# Altium schematic sheet Input.SchDoc
size A4
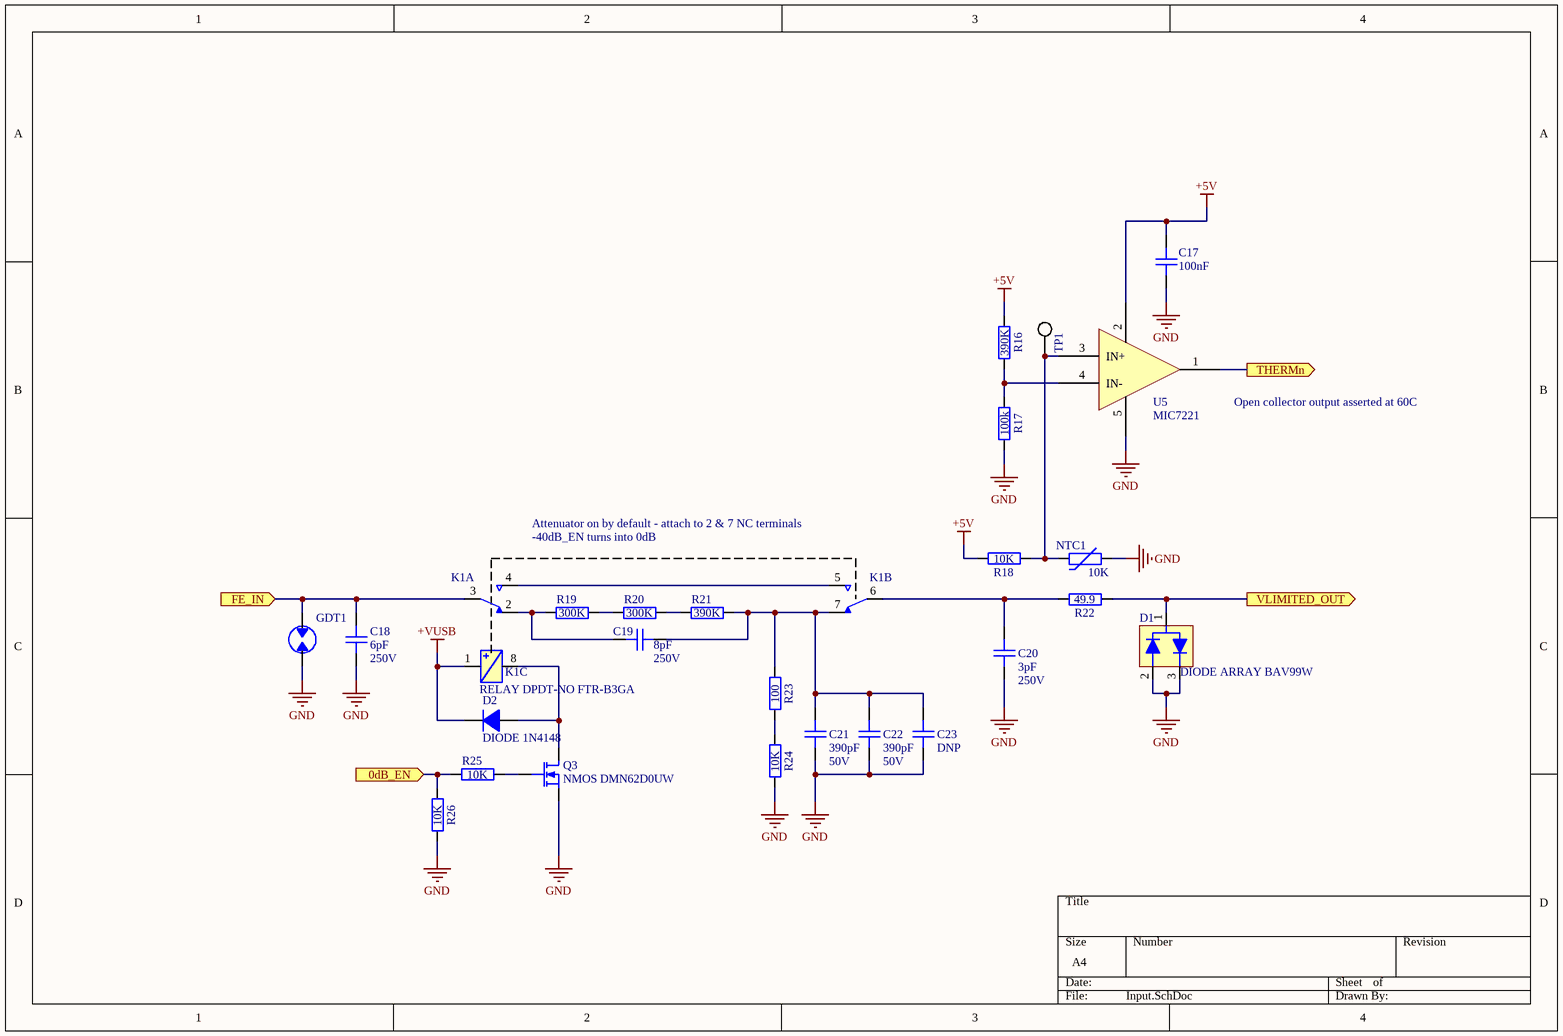
[diagram p0: Input.SchDoc]

## Parts
C17  value 100nF  [GEN_C_0402]  (hidden comment: CAP 100nF 16V X7R 0402)
C18  value 6pF  Voltage Rating: 250V  [GEN_C_0603]  (hidden comment: CAP 6pF 250V C0G 0603)
C19  value 8pF  Voltage Rating: 250V  [GEN_C_0603]  (hidden comment: CAP 8pF 250V C0G 0603)
C20  value 3pF  Voltage Rating: 250V  [GEN_C_0603]  (hidden comment: CAP 3pF 250V C0G 0603)
C21  value 390pF  Voltage Rating: 50V  [GEN_C_0402]  (hidden comment: CAP 390pF 50V C0G 0402)
C22  value 390pF  Voltage Rating: 50V  [GEN_C_0402]  (hidden comment: CAP 390pF 50V C0G 0402)
C23  value DNP  [GEN_C_0402]  (hidden comment: CAP DNP 0402)
D1  DIODE ARRAY BAV99W  [GEN_SOT_323]
D2  DIODE 1N4148  [GEN_SOD_323]
GDT1  GDT 90V  [BOU_2051]  (value not drawn)
K1  RELAY DPDT-NO FTR-B3GA  [FUJ_FTR-B3GA]  (value not drawn)  (parts A,B,C of 3)
NTC1  value 10K  [GEN_R_0402]  (hidden comment: NTC 10K 3900K 0402)
Q3  NMOS DMN62D0UW  [GEN_SOT_323]
R16  value 390K  [GEN_R_0402]  (hidden comment: RES 390K OHM 1% 1/10W 0402)
R17  value 100k  [GEN_R_0402]  (hidden comment: RES 100K OHM 1% 1/10W 0402)
R18  value 10K  [GEN_R_0402]  (hidden comment: RES 10K OHM 1% 1/10W 0402)
R19  value 300K  [GEN_R_0402]  (hidden comment: RES 300K OHM 1% 1/10W 0402)
R20  value 300K  [GEN_R_0402]  (hidden comment: RES 300K OHM 1% 1/10W 0402)
R21  value 390K  [GEN_R_0402]  (hidden comment: RES 390K OHM 1% 1/10W 0402)
R22  49.9  [GEN_R_0402]
R23  value 100  [GEN_R_0402]  (hidden comment: RES 100 OHM 1% 1/10W 0402)
R24  value 10K  [GEN_R_0402]  (hidden comment: RES 10K OHM 1% 1/10W 0402)
R25  value 10K  [GEN_R_0402]  (hidden comment: RES 10K OHM 1% 1/10W 0402)
R26  value 10K  [GEN_R_0402]  (hidden comment: RES 10K OHM 1% 1/10W 0402)
TP1  5019  [KEY_5019]  (value not drawn)
U5  MIC7221  [GEN_SOT23_5_950_2900X1600X1450]

## Ports
0dB_EN (in), FE_IN (in), THERMn (out), VLIMITED_OUT (out)

## Nets
+5V: C17.1 R16.1 R18.2 U5.2(V+)
+VUSB: D2.1(K) K1.1
GND: C17.2 C18.1 C20.2 C21.1 C22.1 C23.1 D1.2 D1.3 GDT1.2 NTC1.2 Q3.3(S) R17.2 R24.1 R26.1 U5.5(V-)
0dB_EN: R25.2 R26.2 ; port 0dB_EN
FE_IN: C18.2 GDT1.1 K1.3 ; port FE_IN
THERMn: U5.1(OUT) ; port THERMn
VLIMITED_OUT: D1.1 R22.2 ; port VLIMITED_OUT
NetC19_1: C19.1 C21.2 C22.2 C23.2 K1.7 R21.2 R23.2
NetC19_2: C19.2 K1.2 R19.1
NetC20_1: C20.1 K1.6 R22.1
NetD2_2: D2.2(A) K1.8 Q3.1(D)
NetK1_4: K1.4 K1.5
NetNTC1_1: NTC1.1 R18.1 TP1.1 U5.3(IN+)
NetQ3_2: Q3.2(G) R25.1
NetR16_2: R16.2 R17.1 U5.4(IN-)
NetR19_2: R19.2 R20.1
NetR20_2: R20.2 R21.1
NetR23_1: R23.1 R24.2

## Notes on the sheet
- Open collector output asserted at 60C
- Attenuator on by default - attach to 2 & 7 NC terminals
- -40dB_EN turns into 0dB

## Library data of the parts
D2 = DIODE 1N4148: Max Reverse Voltage: 75V; Max Current: 150mA; Supplier 1: Digi-Key; Supplier Part Number 1: 1N4148WS-FDICT-ND
Q3 = NMOS DMN62D0UW: Vdss: 60V; Id: 340mA; Max Power: 320mW; Supplier 1: Digi-Key; Supplier Part Number 1: DMN62D0UW-7DICT-ND
R16 R21 = RES 390K OHM 1% 1/10W 0402: Power Rating: 0.1W; Tolerance: 1%; Package: 0402; Supplier 1: Digi-Key; Supplier Part Number 1: P390KLCT-ND
R17 = RES 100K OHM 1% 1/10W 0402: Power Rating: 0.1W; Tolerance: 1%; Package: 0402; Supplier 1: Digi-Key; Supplier Part Number 1: P100KLCT-ND
R18 R24-R26 = RES 10K OHM 1% 1/10W 0402: Power Rating: 0.1W; Tolerance: 1%; Package: 0402; Supplier 1: Digi-Key; Supplier Part Number 1: P10.0KLCT-ND
R19 R20 = RES 300K OHM 1% 1/10W 0402: Power Rating: 0.1W; Tolerance: 1%; Package: 0402; Supplier 1: Digi-Key; Supplier Part Number 1: P300KLCT-ND
R22 = RES 49.9 OHM 1% 1/10W 0402: Tolerance: 1%; Power Rating: 0.1W; Package: 0402; Supplier 1: Digi-Key; Supplier Part Number 1: P49.9LCT-ND; Value: 49.9
R23 = RES 100 OHM 1% 1/10W 0402: Power Rating: 0.1W; Tolerance: 1%; Package: 0402; Supplier 1: Digi-Key; Supplier Part Number 1: P100LCT-ND
TP1 = TP KEYSTONE 5019: Supplier 1: Digi-Key; Supplier Part Number 1: 36-5019CT-ND
U5 = IC COMP MIC7221YM5: Supplier 1: Digi-Key; Supplier Part Number 1: 576-2901-1-ND
C17 = CAP 100nF 16V X7R 0402: Package: 0402; Voltage Rating: 16V; Supplier 1: Digi-Key; Supplier Part Number 1: 490-4759-1-ND
C18 = CAP 6pF 250V C0G 0603: Supplier 1: Digi-Key; Supplier Part Number 1: 399-8734-1-ND; Package: 0603
C19 = CAP 8pF 250V C0G 0603: Package: 0603; Supplier 1: Digi-Key; Supplier Part Number 1: 399-8740-1-ND
C20 = CAP 3pF 250V C0G 0603: Package: 0603; Supplier 1: Digi-Key; Supplier Part Number 1: 399-8820-1-ND
C21 C22 = CAP 390pF 50V C0G 0402: Package: 0402; Supplier 1: Digi-Key; Supplier Part Number 1: 490-8202-1-ND
C23 = CAP DNP 0402: Package: 0402
D1 = DIODE ARRAY BAV99W: Supplier 1: Digi-Key; Supplier Part Number 1: BAV99W-FDICT-ND
GDT1 = GDT 90V: Supplier 1: Digi-Key; Supplier Part Number 1: 2051-09-SM-RPLFCT-ND
NTC1 = NTC 10K 3900K 0402: Package: 0402; B Value: 3900k; Supplier 1: Digi-Key; Supplier Part Number 1: P12985CT-ND